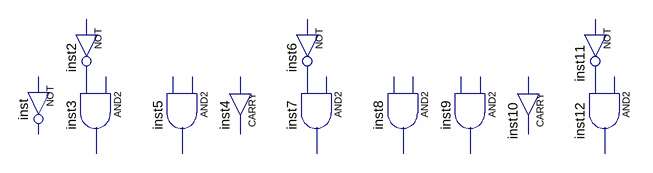
[diagram p0: schematic sheet]
// Quartus schematic 74LS283.bdf as structural Verilog: 12 symbols, 0 pins
module \74LS283  (
);

  wire inst2_out, inst6_out, inst11_out;

  // NOT inst is placed but not wired
  // NOT inst2 has open pins: IN=open, OUT=inst2_out
  // AND2 inst3 has open pins: IN1=open, IN2=inst2_out, OUT=open
  // AND2 inst5 is placed but not wired
  CARRY inst4 ();  // open: IN, OUT
  // NOT inst6 has open pins: IN=open, OUT=inst6_out
  // AND2 inst7 has open pins: IN1=open, IN2=inst6_out, OUT=open
  // AND2 inst8 is placed but not wired
  // AND2 inst9 is placed but not wired
  // NOT inst11 has open pins: IN=open, OUT=inst11_out
  CARRY inst10 ();  // open: IN, OUT
  // AND2 inst12 has open pins: IN1=open, IN2=inst11_out, OUT=open
endmodule
